# EAGLE design covox (EAGLE 7.3.0)
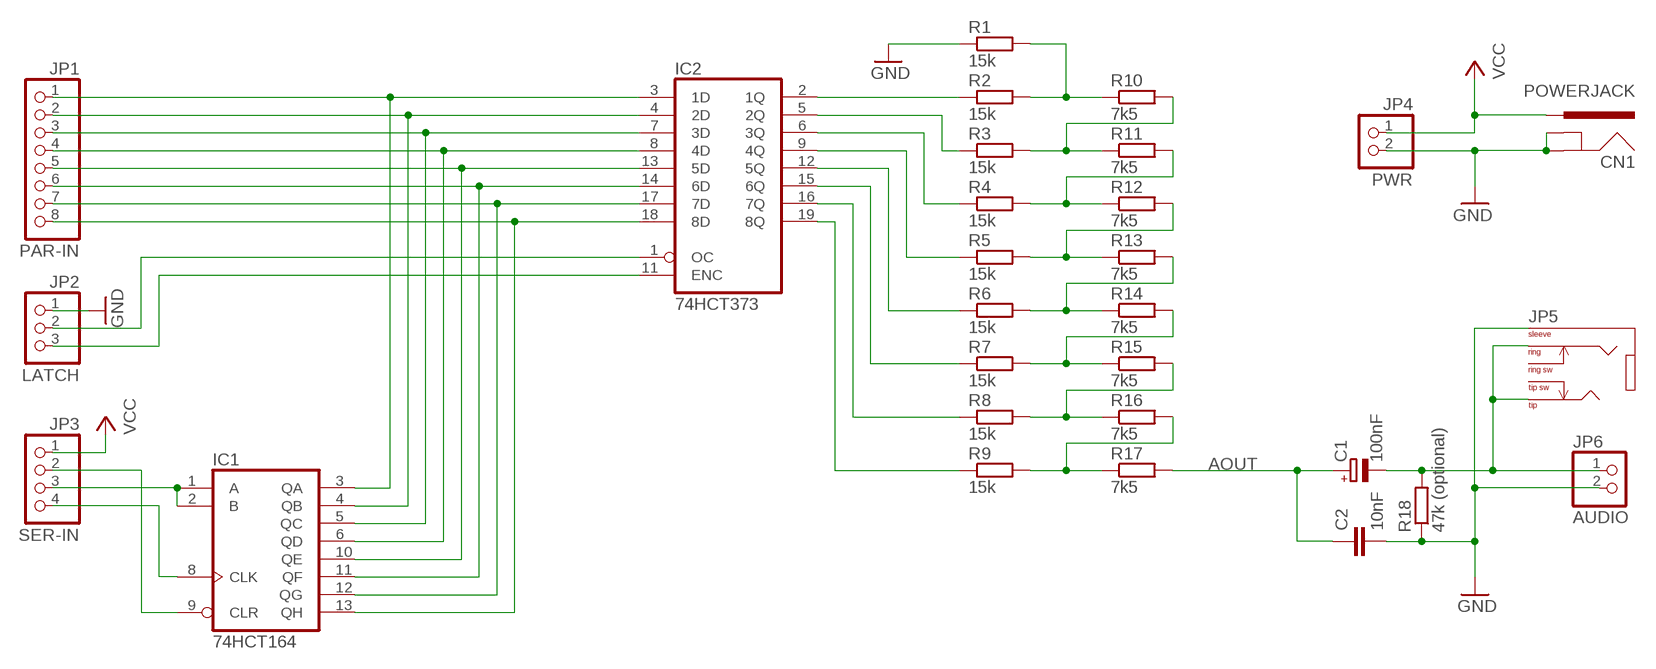
[diagram p0: schematic, sheet 1]

## Parts
C1  100nF  CPOL-EUE2-4  [E2-4]
C2  10nF  C-EU025-025X050  [C025-025X050]
CN1  POWERJACK  POWERJACK-SLOT  [POWERJACK_SLOT]
IC1  74HCT164  74HC164N  [DIL14]
IC2  74HCT373  74HCT373N  [DIL20]
JP1  PAR-IN  PINHD-1X8  [1X08]
JP2  LATCH  PINHD-1X3  [1X03]
JP3  SER-IN  PINHD-1X4  [1X04]
JP4  PWR  PINHD-1X2  [1X02]
JP5  AUDIO  AUDIO-JACK-3.5MM  [AUDIO-JACK-3.5MM]
JP6  AUDIO  PINHD-1X2  [1X02]
R1  15k  R-EU_0204/7  [0204/7]
R2  15k  R-EU_0204/7  [0204/7]
R3  15k  R-EU_0204/7  [0204/7]
R4  15k  R-EU_0204/7  [0204/7]
R5  15k  R-EU_0204/7  [0204/7]
R6  15k  R-EU_0204/7  [0204/7]
R7  15k  R-EU_0204/7  [0204/7]
R8  15k  R-EU_0204/7  [0204/7]
R9  15k  R-EU_0204/7  [0204/7]
R10  7k5  R-EU_0204/7  [0204/7]
R11  7k5  R-EU_0204/7  [0204/7]
R12  7k5  R-EU_0204/7  [0204/7]
R13  7k5  R-EU_0204/7  [0204/7]
R14  7k5  R-EU_0204/7  [0204/7]
R15  7k5  R-EU_0204/7  [0204/7]
R16  7k5  R-EU_0204/7  [0204/7]
R17  7k5  R-EU_0204/7  [0204/7]
R18  47k (optional)  R-EU_0204/7  [0204/7]

## Nets
AOUT: C1.+ C2.1 R17.2
GND [supply]: C2.2 CN1.GND@1(GND) CN1.GND@2(GND) CN1.GND@3(GND) CN1.GNDBREAK@1(GNDBREAK) CN1.GNDBREAK@2(GNDBREAK) CN1.GNDBREAK@3(GNDBREAK) JP2.1 JP4.2 JP5.1 JP6.2 R1.1 R18.1
N$1: R1.2 R2.2 R10.1
N$2: R3.2 R10.2 R11.1
N$3: R4.2 R11.2 R12.1
N$4: R5.2 R12.2 R13.1
N$5: R6.2 R13.2 R14.1
N$6: R7.2 R14.2 R15.1
N$7: R8.2 R15.2 R16.1
N$8: IC2.2(1Q) R2.1
N$9: IC2.5(2Q) R3.1
N$10: IC2.6(3Q) R4.1
N$11: IC2.9(4Q) R5.1
N$12: IC2.12(5Q) R6.1
N$13: IC2.15(6Q) R7.1
N$14: IC2.16(7Q) R8.1
N$15: IC2.19(8Q) R9.1
N$16: IC1.1(A) IC1.2(B) JP3.3
N$17: R9.2 R16.2 R17.1
N$18: IC1.3(QA) IC2.3(1D) JP1.1
N$19: IC1.4(QB) IC2.4(2D) JP1.2
N$20: IC1.5(QC) IC2.7(3D) JP1.3
N$21: IC1.6(QD) IC2.8(4D) JP1.4
N$22: IC1.10(QE) IC2.13(5D) JP1.5
N$23: IC1.11(QF) IC2.14(6D) JP1.6
N$24: IC1.12(QG) IC2.17(7D) JP1.7
N$25: IC1.13(QH) IC2.18(8D) JP1.8
N$26: IC2.1(OC) JP2.2
N$27: IC2.11(ENC) JP2.3
N$30: IC1.9(CLR) JP3.2
N$31: IC1.8(CLK) JP3.4
N$32: C1.- JP5.2 JP5.3 JP6.1 R18.2
VCC [supply]: CN1.PWR@1(PWR) CN1.PWR@2(PWR) CN1.PWR@3(PWR) JP3.1 JP4.1
Unconnected: JP5.4 JP5.5

## Power pins joined to a net without a drawn wire
GND: IC1.7(GND) IC2.10(GND)
VCC: IC1.14(VCC) IC2.20(VCC)

## Library data of the parts
C1 = rcl:CPOL-EU: POLARIZED CAPACITOR, European symbol
C2 = rcl:C-EU: CAPACITOR, European symbol
CN1 = KaiBader:POWERJACK: Power Jack Standard 2.1 mm * 5.5 mm barrel jack for power (e.g. Arduino).
IC1 = 74xx-eu:74*164: 8-bit parallel out SHIFT REGISTER
IC2 = 74xx-eu:74*373: Octal D type transparent LATCH, edge triggered
JP1 = pinhead:PINHD-1X8: PIN HEADER
JP2 = pinhead:PINHD-1X3: PIN HEADER
JP3 = pinhead:PINHD-1X4: PIN HEADER
JP4 JP6 = pinhead:PINHD-1X2: PIN HEADER
JP5 = KaiBader:AUDIO-JACK-3.5MM: 3.5mm Audio Jack SJ1-351X Series (SJ1-3513/SJ1-3514/SJ13515)
R1-R18 = rcl:R-EU_: RESISTOR, European symbol

## Net classes
0 default: width 0.305 mm, drill 0.508 mm, clearance 0.305 mm
1 supply: width 0.508 mm, drill 0.508 mm, clearance 0.305 mm

## Board
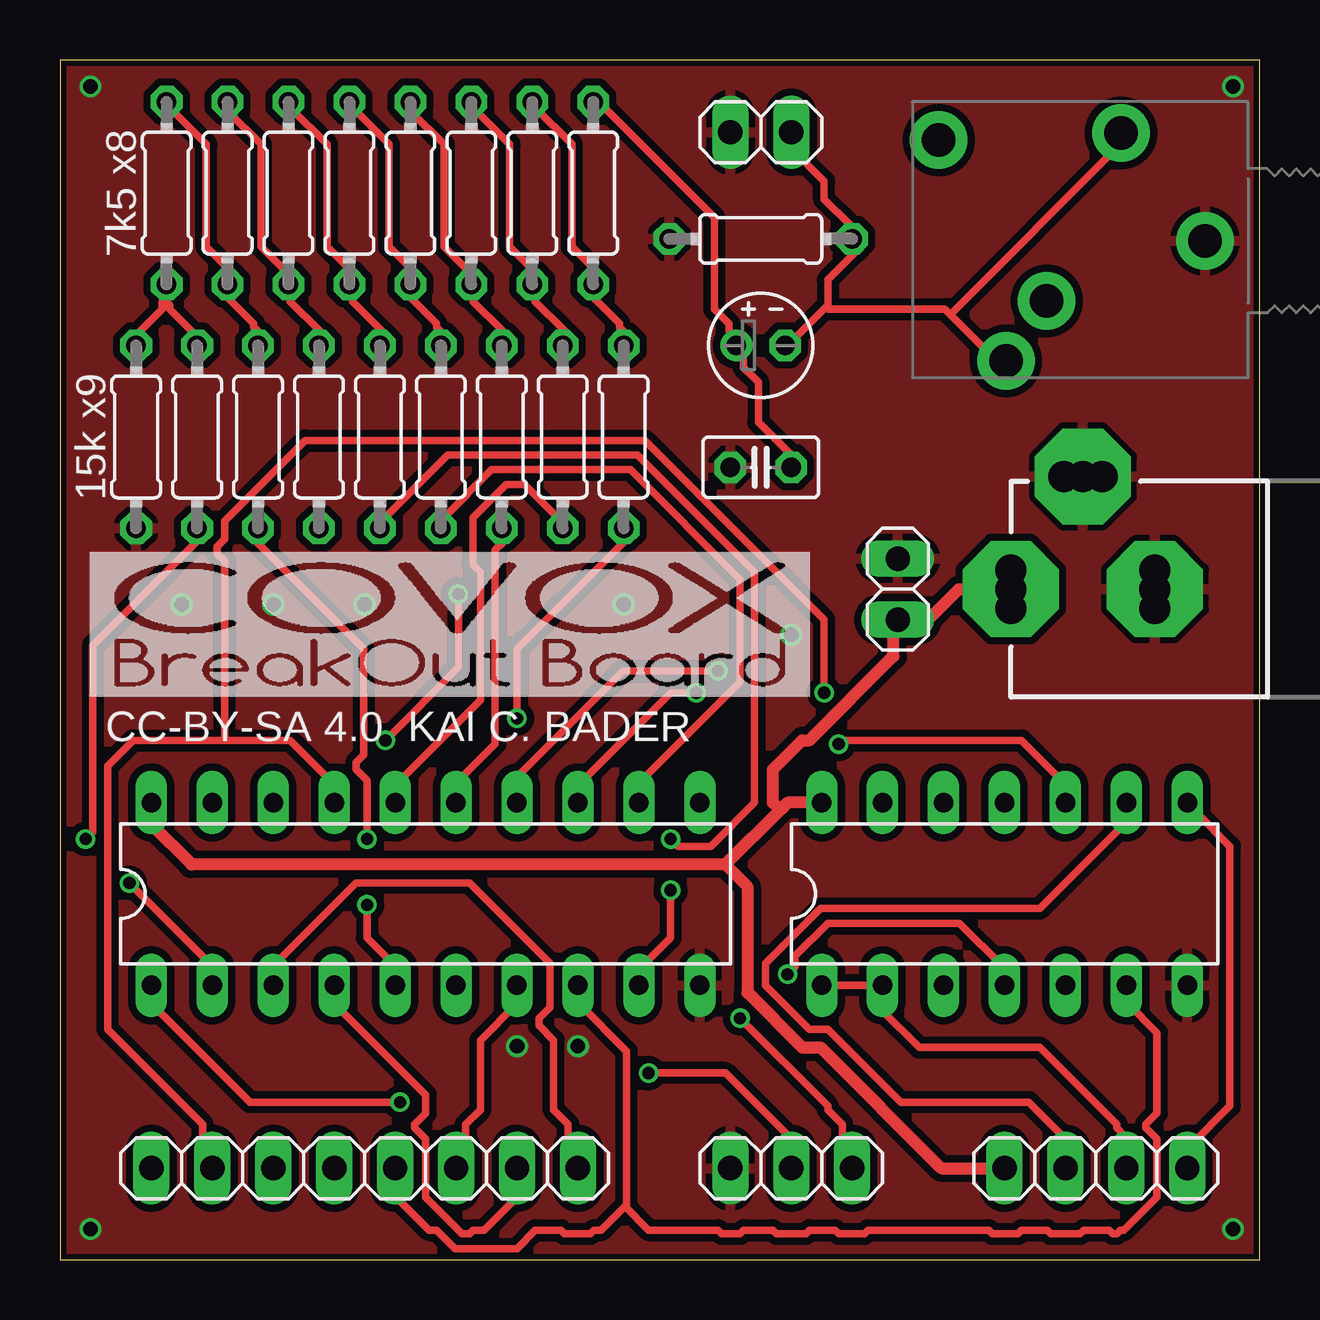
[diagram p1: board, top side]
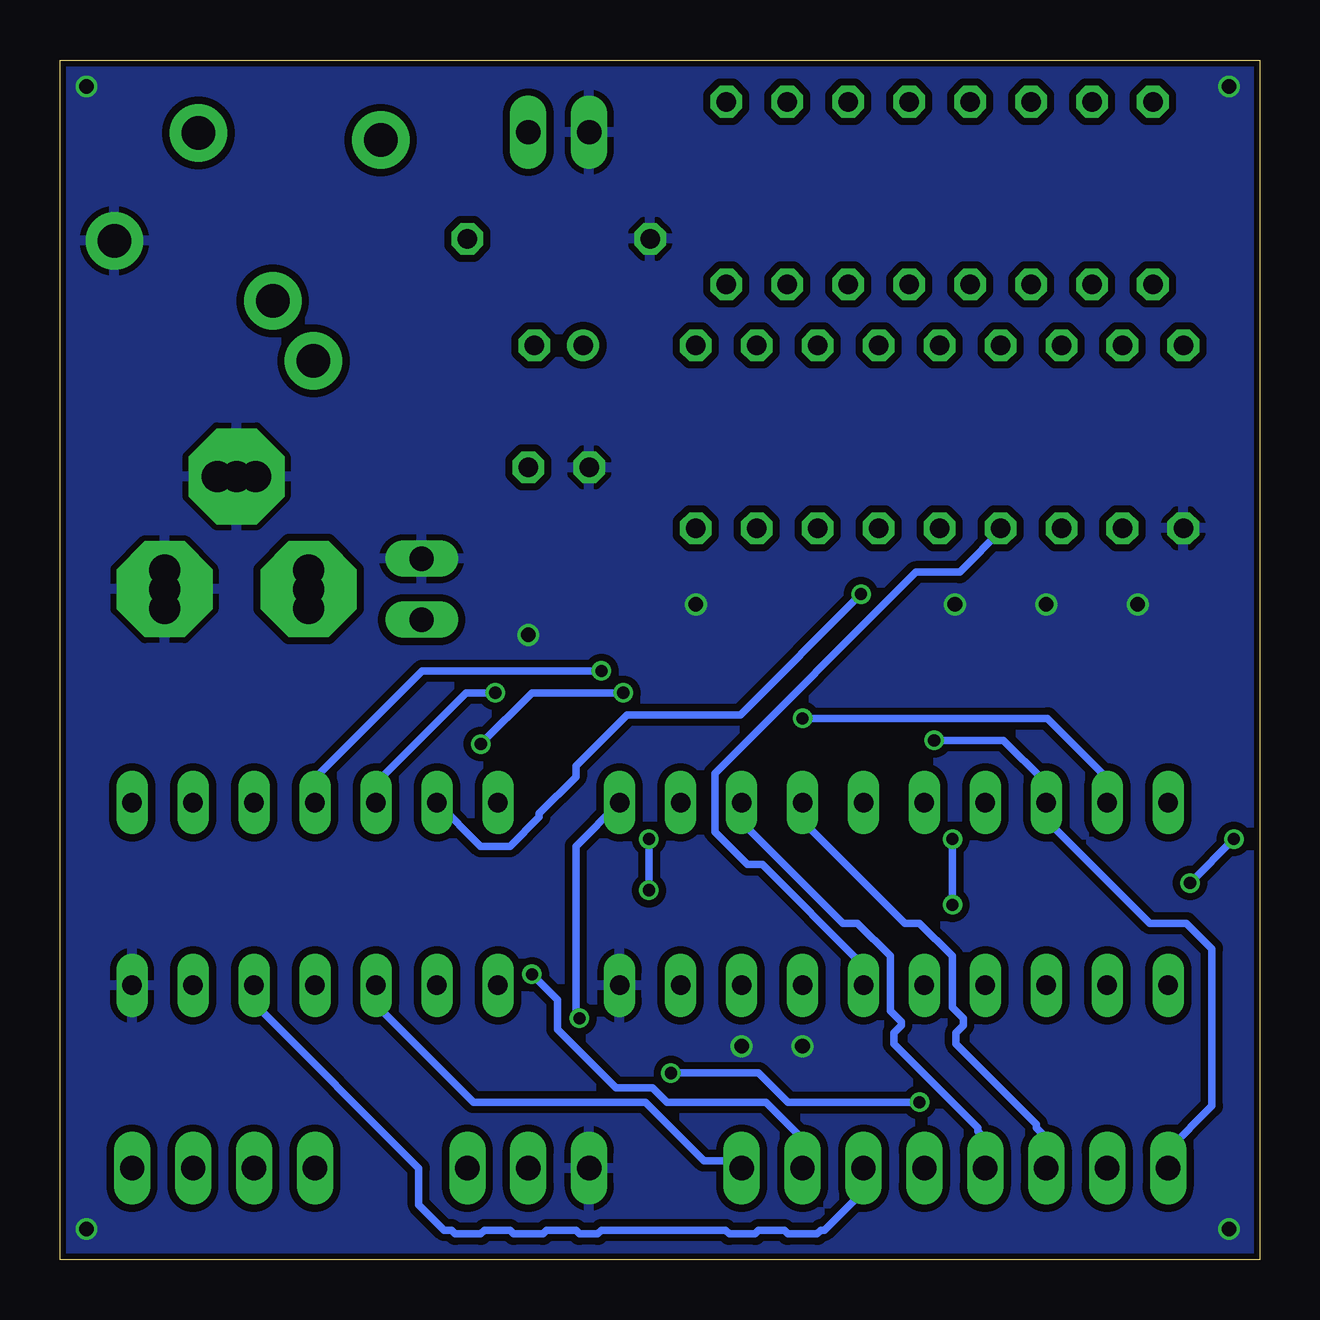
[diagram p2: board, bottom side, seen from below]

Size 50 x 50 mm. Coordinates in mm from the lower left corner, seen from the top.
Outline: 0,0 50,0 50,50 0,50 0,0
Copper layers (1*16): Top 0.035mm / dielectric 1.5mm / Bottom 0.035mm
Design rules "dirt_cheap_dirty_boards.v1": minimum track width 5mil, minimum drill 12mil, track to track 5mil, track to pad 5mil, pad to pad 5mil, via to via 5mil, smd to smd 0mil, copper to edge 10mil, drill to drill 10mil, minimum pad ring 10mil, minimum via ring 6mil, stop-mask expansion 2mil, vias tented up to drill 25mil, thermal gap 10mil

### Footprints (pad centres in the part's own frame; a part is rotated, then mirrored left to right if it is on the bottom)
E2-4 = drill 0.813 pad 1.27: + -1.016,0 | drill 0.813 pad 1.27 octagon: - 1.016,0
C025-025X050 = drill 0.813 octagon: 1 -1.27,0; 2 1.27,0
POWERJACK_SLOT = drill 1.3 pad 4 octagon: GND@1 0,7.7; GNDBREAK@1 4.7,10.7; PWR@1 0,13.7 | drill 1.3 pad 1.5: GND@2 -0.8,7.7; GND@3 0.8,7.7; GNDBREAK@2 4.7,11.5; GNDBREAK@3 4.7,9.9; PWR@2 -0.8,13.7; PWR@3 0.8,13.7
DIL14 = drill 0.813 long: 1 -7.62,-3.81; 2 -5.08,-3.81; 3 -2.54,-3.81; 4 0,-3.81; 5 2.54,-3.81; 6 5.08,-3.81; 7 7.62,-3.81; 8 7.62,3.81; 9 5.08,3.81; 10 2.54,3.81; 11 0,3.81; 12 -2.54,3.81; 13 -5.08,3.81; 14 -7.62,3.81
DIL20 = drill 0.813 long: 1 -11.43,-3.81; 2 -8.89,-3.81; 3 -6.35,-3.81; 4 -3.81,-3.81; 5 -1.27,-3.81; 6 1.27,-3.81; 7 3.81,-3.81; 8 6.35,-3.81; 9 8.89,-3.81; 10 11.43,-3.81; 11 11.43,3.81; 12 8.89,3.81; 13 6.35,3.81; 14 3.81,3.81; 15 1.27,3.81; 16 -1.27,3.81; 17 -3.81,3.81; 18 -6.35,3.81; 19 -8.89,3.81; 20 -11.43,3.81
1X08 = drill 1.016 long: 1 -8.89,0; 2 -6.35,0; 3 -3.81,0; 4 -1.27,0; 5 1.27,0; 6 3.81,0; 7 6.35,0; 8 8.89,0
1X03 = drill 1.016 long: 1 -2.54,0; 2 0,0; 3 2.54,0
1X04 = drill 1.016 long: 1 -3.81,0; 2 -1.27,0; 3 1.27,0; 4 3.81,0
1X02 = drill 1.016 long: 1 -1.27,0; 2 1.27,0
AUDIO-JACK-3.5MM = drill 1.4 pad 2.4: 1 1.8,5.8; 2 5.3,1.3; 3 10.1,10.8; 4 12.9,1.6; 5 8.4,8.3
0204/7 = drill 0.813 octagon: 1 -3.81,0; 2 3.81,0

### Placement (x,y rotation side)
C1  29.21,38.1 0 top
C2  29.21,33.02 180 top
CN1  53.34,27.94 90 top
IC1  39.37,15.24 0 top
IC2  15.24,15.24 0 top
JP1  12.7,3.81 180 top
JP2  30.48,3.81 0 top
JP3  43.18,3.81 0 top
JP4  34.92,27.94 90 top
JP5  49.53,48.26 180 top
JP6  29.21,46.99 180 top
R1  3.17,34.29 90 top
R2  5.71,34.29 90 top
R3  8.26,34.29 90 top
R4  10.79,34.29 90 top
R5  13.34,34.29 90 top
R6  15.88,34.29 90 top
R7  18.41,34.29 90 top
R8  20.95,34.29 90 top
R9  23.5,34.29 90 top
R10  4.45,44.45 90 top
R11  6.99,44.45 90 top
R12  9.53,44.45 90 top
R13  12.06,44.45 90 top
R14  14.61,44.45 90 top
R15  17.14,44.45 90 top
R16  19.68,44.45 90 top
R17  22.23,44.45 90 top
R18  29.21,42.55 0 top
U$2  [COVOX_LOGO_600]  1.27,23.5 0 top

### Tracks (layer width: path | path; a pad name or v marks a point on that pad's centre or on a via)
AOUT
  Top 0.305: C2.1 30.48,33.53 29.11,34.9 29.11,36.58 28.5,37.19 28.5,37.49 28.19,37.8 C1.+ 28.19,38.41 27.89,38.71 27.89,39.01 27.28,39.62 27.28,43.43 22.55,48.16 22.25,48.16 R17.2
GND  (via drill 0.61 pad 0.91)
  other vias: 1.27,48.9 48.9,48.9 48.9,1.27 1.27,1.27 5.08,27.3 8.89,27.3 12.7,27.3 23.5,27.3 30.48,26.04 19.05,8.89 21.59,8.89
  pour Bottom: 0,0 50,0 50,50 0,50
  pour Top: 0,0 50,0 50,50 0,50
N$1
  Top 0.305: 4.34,40.01 4.42,40.08 4.42,40.54 R10.1 | 4.34,40.01 4.27,39.93 4.27,39.62 3.2,38.56 3.2,38.1 R1.2 | 4.34,40.01 4.57,39.78 4.57,39.62 5.64,38.56 5.64,38.1 R2.2
N$2
  Top 0.305: R3.2 8.23,38.1 8.23,38.71 8.08,38.86 8.08,39.01 7.01,40.08 7.01,40.54 R11.1 7.16,40.54 7.16,41.15 6.1,42.22 6.1,46.48 4.57,48.01 4.57,48.16 R10.2
N$3
  Top 0.305: R4.2 10.82,38.1 10.82,38.71 9.6,39.93 9.6,40.54 R12.1 9.45,40.69 9.45,41.15 8.38,42.22 8.38,46.48 7.01,47.85 7.01,48.16 R11.2
N$4
  Top 0.305: R5.2 13.41,38.1 13.41,38.71 12.19,39.93 12.19,40.54 R13.1 12.19,40.69 12.19,41.15 11.12,42.22 11.12,46.48 9.6,48.01 9.6,48.16 R12.2
N$5
  Top 0.305: R6.2 15.85,38.1 15.85,38.71 15.7,38.86 15.7,39.01 14.63,40.08 14.63,40.54 R14.1 14.78,40.54 14.78,41.15 13.72,42.22 13.72,46.48 12.19,48.01 12.19,48.16 R13.2
N$6
  Top 0.305: R7.2 18.44,38.1 18.44,38.71 17.22,39.93 17.22,40.54 R15.1 17.07,40.69 17.07,41.15 16,42.22 16,46.48 14.63,47.85 14.63,48.16 R14.2
N$7
  Top 0.305: R8.2 21.03,38.1 21.03,38.71 19.81,39.93 19.81,40.54 R16.1 19.81,40.69 19.81,41.15 18.75,42.22 18.75,46.48 17.22,48.01 17.22,48.16 R15.2
N$8  (via drill 0.51)
  Top 0.305: v2.9,15.7 6.25,12.34 6.25,11.43 IC2.2 | v1.07,17.53 1.37,17.83 1.37,25.6 5.64,29.87 5.64,30.48 R2.1
  Bottom 0.305: v1.07,17.53 v2.9,15.7
N$9  (via drill 0.51)
  Top 0.305: v12.8,14.78 12.8,13.41 13.87,12.34 13.87,11.43 IC2.5 | v12.8,17.53 12.8,19.96 12.34,20.42 12.34,20.73 12.65,21.03 12.65,25.45 8.23,29.87 8.23,30.48 R3.1
  Bottom 0.305: v12.8,17.53 v12.8,14.78
N$10
  Bottom 0.305: IC2.6 16.61,11.43 16.61,12.34 20.73,16.46 21.34,16.46 22.71,17.83 22.71,20.27 14.33,28.65 12.5,28.65 10.67,30.48 R4.1
N$11  (via drill 0.51)
  Top 0.305: v25.45,15.39 25.45,13.41 24.23,12.19 24.23,11.43 IC2.9 | v25.45,17.53 25.76,17.22 27.13,17.22 28.96,19.05 28.96,28.65 24.08,33.53 16.15,33.53 13.41,30.79 13.41,30.48 R5.1
  Bottom 0.305: v25.45,17.53 v25.45,15.39
N$12
  Top 0.305: IC2.12 24.23,19.05 24.23,19.96 28.35,24.08 28.35,28.35 23.77,32.92 17.98,32.92 16,30.94 16,30.48 R6.1
N$13
  Top 0.305: IC2.15 16.61,19.05 16.61,19.96 18.14,21.49 18.14,29.57 18.44,29.87 18.44,30.48 R7.1
N$14
  Top 0.305: IC2.16 14.02,19.05 14.02,19.81 17.53,23.32 17.53,28.65 17.22,28.96 17.22,30.94 18.59,32.31 19.36,32.31 20.88,30.79 20.88,30.48 R8.1
N$15  (via drill 0.51)
  Top 0.305: v19.05,22.55 19.05,25.45 23.47,29.87 23.47,30.48 R9.1
  Bottom 0.305: v19.05,22.55 8.84,22.55 6.4,20.12 6.4,19.05 IC2.19
N$16
  Top 0.305: IC1.1 IC1.2 34.29,10.36 35.81,8.84 40.84,8.84 44.04,5.64 44.04,5.49 44.35,5.18 44.35,3.81 JP3.3
N$17
  Top 0.305: R9.2 23.47,38.1 23.47,38.71 23.32,38.86 23.32,39.01 22.25,40.08 22.25,40.54 R17.1 22.4,40.54 22.4,41.15 21.34,42.22 21.34,46.48 19.81,48.01 19.81,48.16 R16.2
N$18
  Top 0.305: IC2.3 8.99,11.43 8.99,12.34 12.34,15.7 17.07,15.7 20.42,12.34 20.42,10.52 19.96,10.06 19.96,9.75 20.57,9.14 20.57,6.25 21.18,5.64 21.18,5.18 21.49,4.88 21.49,3.81 JP1.1
  Bottom 0.305: IC1.3 36.73,11.43 36.73,10.52 32.77,6.55 25.6,6.55 23.16,4.12 21.95,4.12 21.64,3.81 JP1.1
N$19  (via drill 0.51)
  Top 0.305: IC2.4 11.43,10.67 15.24,6.86 15.24,6.1 14.78,5.64 14.78,5.49 15.24,5.03 15.24,2.59 16.76,1.07 17.07,1.07 17.22,1.22 17.68,1.22 19.05,2.59 JP1.2 | v30.33,11.89 30.63,12.19 30.63,12.65 32,14.02 37.49,14.02 39.32,12.19 39.32,11.43 IC1.4
  Bottom 0.305: v30.33,11.89 29.26,10.82 29.26,9.6 26.82,7.16 25.3,7.16 24.69,6.55 20.57,6.55 19.05,5.03 JP1.2
N$20
  Top 0.305: IC2.7 19.05,10.67 17.53,9.14 17.53,6.25 16.92,5.64 16.92,5.18 16.61,4.88 16.61,3.81 JP1.3
  Bottom 0.305: IC1.5 41.91,10.67 35.05,3.81 35.05,2.29 33.98,1.22 33.68,1.22 33.53,1.07 32.46,1.07 32.31,1.22 31.24,1.22 31.09,1.07 29.87,1.07 29.72,1.22 28.5,1.22 28.35,1.07 27.58,1.07 27.43,1.22 22.25,1.22 22.1,1.07 21.03,1.07 20.88,1.22 19.81,1.22 19.66,1.07 18.44,1.07 18.29,1.22 18.14,1.22 16.61,2.74 16.61,3.81 JP1.3
N$21
  Top 0.305: 23.55,2.21 22.55,1.22 22.25,1.22 22.1,1.07 21.03,1.07 20.88,1.22 19.81,1.22 19.05,0.46 16.46,0.46 15.7,1.22 15.39,1.22 14.02,2.59 14.02,3.81 JP1.4 | 23.55,2.21 23.62,2.29 23.62,8.69 21.64,10.67 21.64,11.43 IC2.8 | 23.55,2.21 24.54,1.22 27.43,1.22 27.58,1.07 28.35,1.07 28.5,1.22 29.72,1.22 29.87,1.07 31.09,1.07 31.24,1.22 32.31,1.22 32.46,1.07 33.53,1.07 33.68,1.22 38.71,1.22 38.86,1.07 39.93,1.07 40.08,1.22 41.15,1.22 41.3,1.07 42.52,1.07 42.67,1.22 43.74,1.22 43.89,1.07 44.04,1.07 44.2,1.22 44.35,1.22 45.72,2.59 45.72,5.03 45.26,5.49 45.26,5.64 45.72,6.1 45.72,9.45 44.5,10.67 44.5,11.43 IC1.6
N$22  (via drill 0.51)
  Top 0.305: IC1.10 41.91,19.81 40.08,21.64 32.61,21.64 v32.46,21.49 | v26.52,23.62 25.45,23.62 21.64,19.81 21.64,19.05 IC2.13
  Bottom 0.305: JP1.5 11.43,5.03 11.73,5.33 11.73,5.49 15.24,8.99 15.24,9.45 14.94,9.75 14.94,9.91 15.39,10.36 15.39,12.65 16.76,14.02 17.37,14.02 21.49,18.14 21.49,19.05 IC2.13 | v32.46,21.49 30.33,23.62 v26.52,23.62
N$23  (via drill 0.51)
  Top 0.305: v27.43,24.54 23.47,24.54 19.05,20.12 IC2.14
  Bottom 0.305: IC2.14 19.05,18.29 14.78,14.02 14.17,14.02 12.8,12.65 12.8,10.52 12.34,10.06 12.34,9.75 12.65,9.45 12.65,8.99 9.3,5.64 9.3,5.49 8.84,5.03 8.84,3.81 JP1.6 | v27.43,24.54 34.9,24.54 39.32,20.12 39.32,19.05 IC1.11
N$24  (via drill 0.51)
  Top 0.305: IC2.17 11.43,19.81 9.6,21.64 6.86,21.64 | 6.86,21.64 3.05,21.64 1.98,20.57 1.98,9.6 5.94,5.64 5.94,5.18 6.25,4.88 6.25,3.81 JP1.7 | v31.85,23.62 31.85,26.67 24.38,34.14 10.21,34.14 6.86,30.79 6.86,30.02 6.55,29.72 6.55,29.41 6.86,29.11 6.86,21.64
  Bottom 0.305: v31.85,23.62 33.07,23.62 36.73,19.96 36.73,19.05 IC1.12
N$25  (via drill 0.51)
  Top 0.305: v16.61,27.74 16.61,24.69 v13.56,21.64
  Bottom 0.305: JP1.8 3.81,4.57 1.98,6.4 1.98,12.95 3.05,14.02 4.57,14.02 8.84,18.29 8.84,19.05 IC2.18 8.99,19.05 8.99,19.96 10.67,21.64 v13.56,21.64 | IC1.13 32.46,17.22 31.24,17.22 30.02,18.44 30.02,18.59 28.5,20.12 28.5,20.57 26.36,22.71 21.64,22.71 v16.61,27.74
N$26  (via drill 0.51)
  Top 0.305: IC2.1 3.81,10.67 7.92,6.55 v14.17,6.55 | v24.54,7.77 27.74,7.77 30.48,5.03 JP2.2
  Bottom 0.305: v14.17,6.55 19.66,6.55 20.88,7.77 v24.54,7.77
N$27  (via drill 0.51)
  Top 0.305: v28.35,10.06 32,6.4 32,6.25 32.61,5.64 32.61,5.18 32.92,4.88 32.92,3.81 JP2.3
  Bottom 0.305: IC2.11 28.5,17.22 28.5,10.21 v28.35,10.06
N$30
  Top 0.305: JP3.2 41.91,5.03 40.39,6.55 35.05,6.55 32,9.6 31.24,9.6 29.41,11.43 29.41,12.34 31.7,14.63 40.84,14.63 44.35,18.14 44.35,19.05 IC1.9
N$31
  Top 0.305: IC1.8 47.09,19.05 47.4,18.75 47.4,18.59 48.77,17.22 48.77,6.4 47.09,4.72 47.09,3.81 JP3.4
N$32
  Top 0.305: 31.93,39.7 32,39.78 32,40.84 33.07,41.91 33.07,42.52 R18.2 32.92,42.67 32.92,43.13 31.85,44.2 31.85,44.96 30.48,46.33 JP6.1 | 31.93,39.7 30.33,38.1 C1.- | 37.11,39.4 36.88,39.62 32,39.62 31.93,39.7 | 37.11,39.4 39.01,37.49 39.32,37.49 JP5.3 | 37.11,39.4 44.2,46.48 44.2,46.94 JP5.2
VCC
  Top 0.508: IC2.20 3.81,18.14 5.49,16.46 27.74,16.46 | 30.02,18.75 30.33,19.05 IC1.14 | 30.02,18.75 27.74,16.46 | JP3.1 36.73,3.81 31.7,8.84 30.94,8.84 28.65,11.12 28.65,15.54 27.74,16.46 | 30.02,18.75 29.72,19.05 29.72,20.42 30.94,21.64 31.24,21.64 34.75,25.15 34.75,26.52 JP4.1 36.2,26.67 37.47,27.94 CN1.PWR@1 | CN1.PWR@1 CN1.PWR@3 | CN1.PWR@1 CN1.PWR@2

### Text on the board
tPlace: CC-BY-SA 4.0 KAI C. BADER
tNames: 7k5 x8 | 15k x9
tValues: GND | SPK | (opt) | GND | VCC | D7 | D6 | D5 | D4 | D3 | D2 | D1 | D0 | GND | OE | LE | VCC | RST | D | CLK